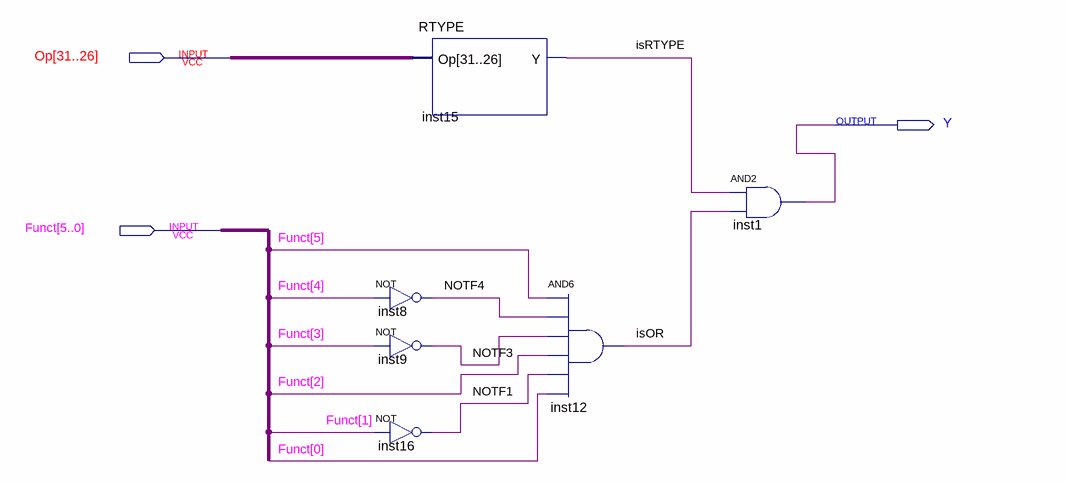
[diagram p0: schematic sheet]
// Quartus schematic ORR.bdf as structural Verilog: 6 symbols, 3 pins
module ORR (
  input  [31:26] Op,
  input  [5:0] Funct,
  output Y
);

  wire isOR, isRTYPE, NOTF1, NOTF3, NOTF4;

  not inst8 (NOTF4, Funct[4]);
  not inst9 (NOTF3, Funct[3]);
  not inst16 (NOTF1, Funct[1]);
  RTYPE inst15 (.Op(Op), .Y(isRTYPE));
  and inst12 (isOR, Funct[5], NOTF4, NOTF3, Funct[2], NOTF1, Funct[0]);
  and inst1 (Y, isRTYPE, isOR);
endmodule
